# EAGLE schematic ESP12-1wire (EAGLE 7.5.0)
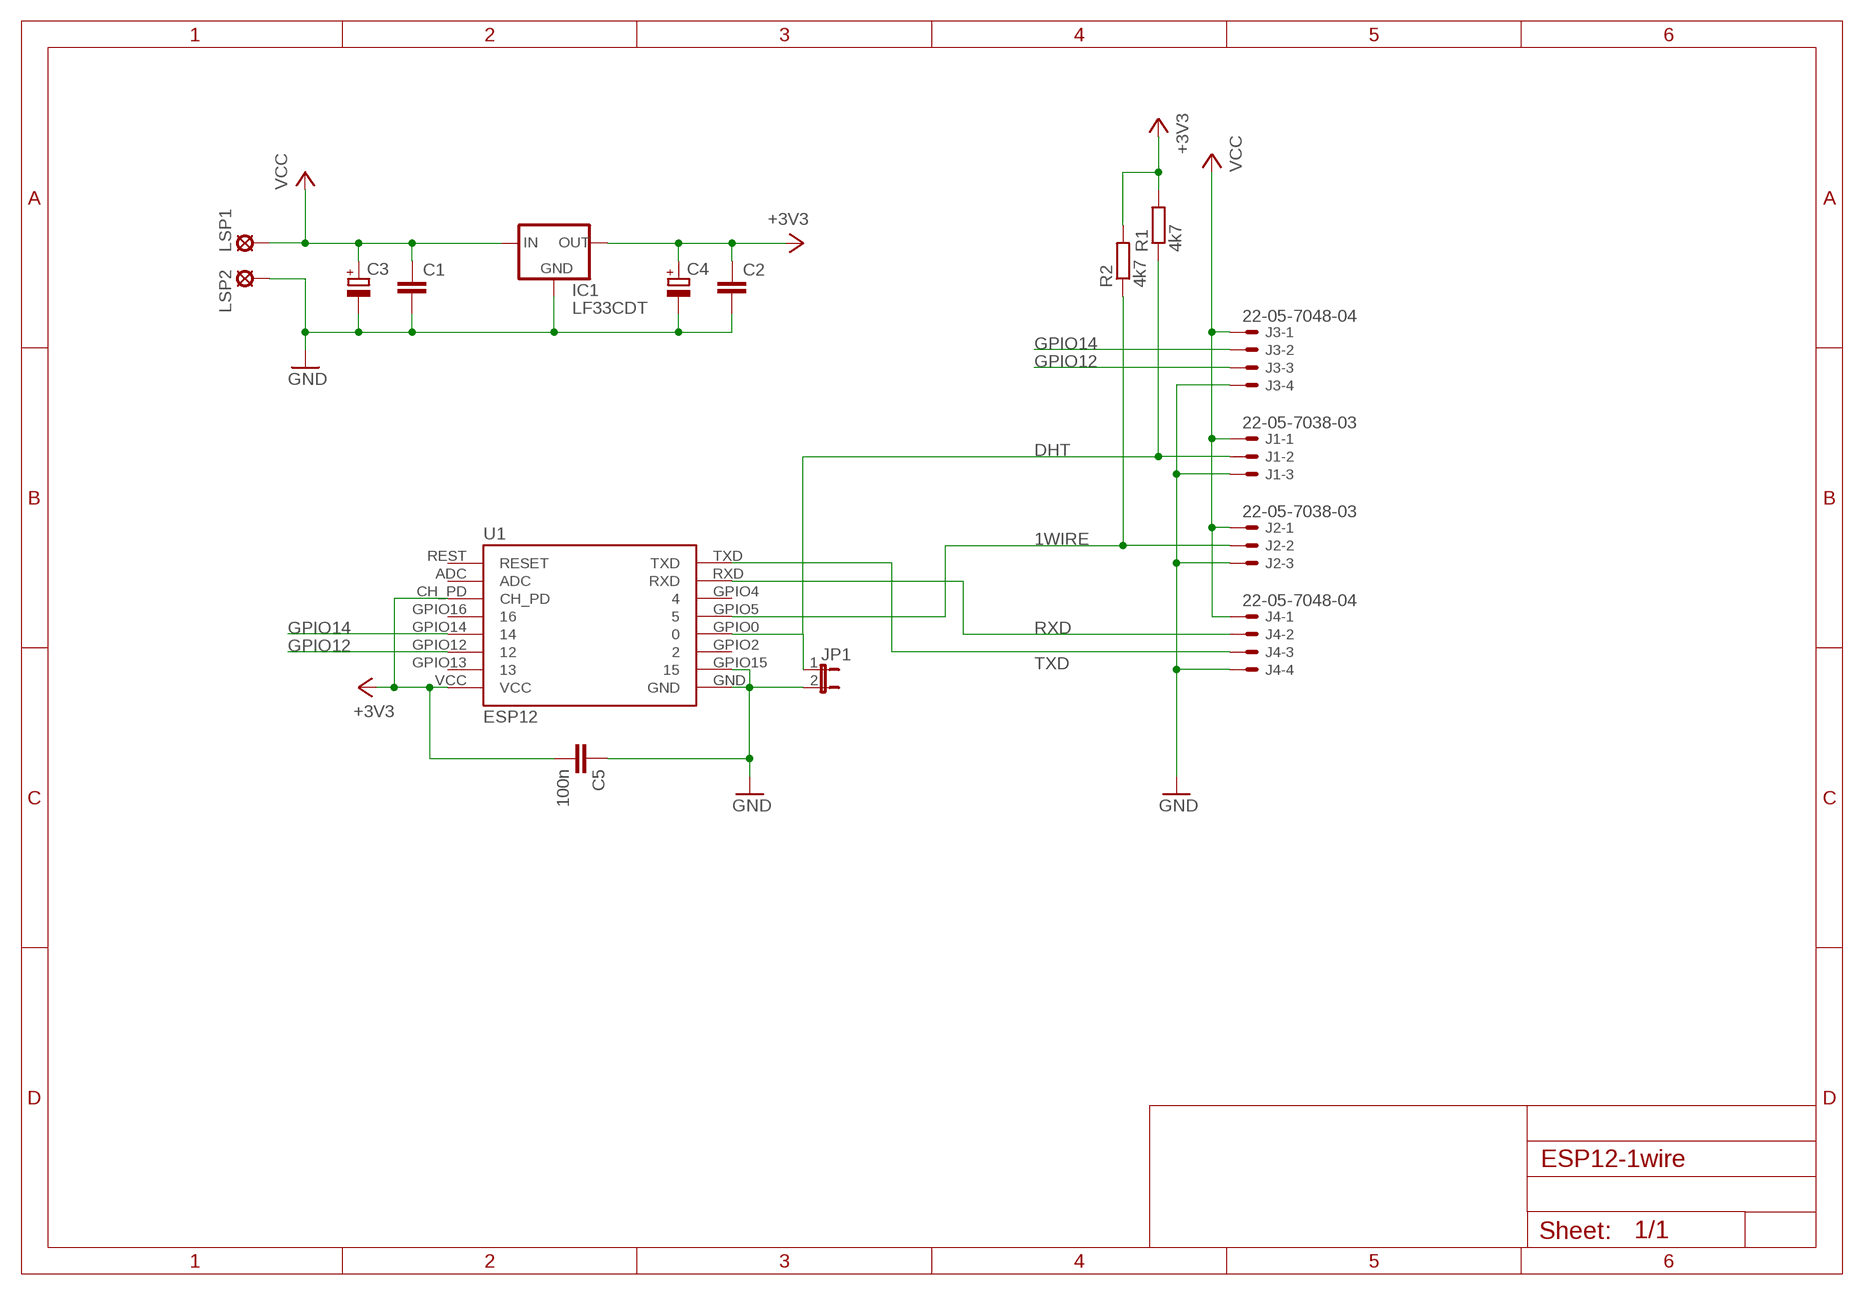
[diagram p0: schematic, sheet 1]

## Parts
C1  C-EUC0805  [C0805]
C2  C-EUC0805  [C0805]
C3  CPOL-EUSMCA  [SMC_A]
C4  CPOL-EUSMCA  [SMC_A]
C5  100n  C-EUC0805  [C0805]
IC1  LF33CDT  LP2950CDT-3.3  [DPACK]
J1  22-05-7038-03  [7395-03]
J2  22-05-7038-03  [7395-03]
J3  22-05-7048-04  [7395-04]
J4  22-05-7048-04  [7395-04]
JP1  JP1E  [JP1]
LSP1  LSP10  [LSP10]
LSP2  LSP10  [LSP10]
R1  4k7  R-EU_R0805  [R0805]
R2  4k7  R-EU_R0805  [R0805]
U1  ESP12  [ESP12]

## Nets
1WIRE: J2.2 R2.1 U1.GPIO5
+3V3: C2.1 C4.+ C5.2 IC1.3(OUT) R1.2 R2.2 U1.CH_PD U1.VCC
DHT: J1.2 JP1.1 R1.1 U1.GPIO0
GND: C1.2 C2.2 C3.- C4.- C5.1 IC1.4(GND) J1.3 J2.3 J3.4 J4.4 JP1.2 LSP2.MP U1.GND U1.GPIO15
GPIO12: J3.3 U1.GPIO12
GPIO14: J3.2 U1.GPIO14
RXD: J4.2 U1.RXD
TXD: J4.3 U1.TXD
VCC: C1.1 C3.+ IC1.1(IN) J1.1 J2.1 J3.1 J4.1 LSP1.MP
Unconnected: U1.ADC U1.GPIO2 U1.GPIO4 U1.GPIO13 U1.GPIO16 U1.REST(RESET)

## Library data of the parts
C1 C2 C5 = rcl:C-EU: CAPACITOR, European symbol
C3 C4 = rcl:CPOL-EU: POLARIZED CAPACITOR, European symbol
IC1 = v-reg:LP2950?*: Source: http://cache.national.com/ds/LP/LP2950.pdf
J1 J2 = con-molex:22-?-03: CONNECTOR wire to board 2.54 mm (.1 inch) pitch header; OC_FARNELL: unknown; OC_NEWARK: unknown
J3 J4 = con-molex:22-?-04: CONNECTOR wire to board 2.54 mm (.1 inch) pitch header; OC_FARNELL: unknown; OC_NEWARK: unknown
JP1 = jumper:JP1E: JUMPER
LSP1 LSP2 = solpad:LSP10: SOLDER PAD drill 1.0 mm, distributor Buerklin, 12H555
R1 R2 = rcl:R-EU_: RESISTOR, European symbol
U1 = ESP:ESP12: Wi07-12 Footprint